# EAGLE design solarIn (EAGLE 7.1.0)
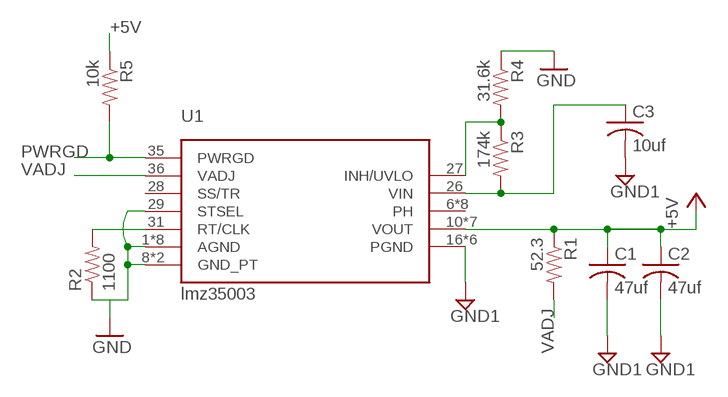
[diagram p0: schematic, sheet 1]

## Parts
C1  47uf  C-USC0805  [C0805]
C2  47uf  C-USC0805  [C0805]
C3  10uf  C-USC0805  [C0805]
R1  52.3  RESISTOR0603-RES  [0603-RES]
R2  1100  RESISTOR0603-RES  [0603-RES]
R3  174k  RESISTOR0603-RES  [0603-RES]
R4  31.6k  RESISTOR0603-RES  [0603-RES]
R5  10k  RESISTOR0603-RES  [0603-RES]
U1  LMZ35003  [S-PB1QFN-N41]

## Nets
+5V: R5.1
GND: R2.1 R4.1 U1.1(AGND) U1.4(AGND) U1.5(AGND) U1.8(GND_PT) U1.9(GND_PT) U1.29(STSEL) U1.30(AGND) U1.32(AGND) U1.33(AGND) U1.34(AGND) U1.37(AGND)
GND1: C1.2 C2.2 C3.2 U1.16(PGND) U1.17(PGND) U1.18(PGND) U1.19(PGND) U1.20(PGND) U1.40(PGND)
N$2: R2.2 U1.31(RT/CLK)
N$3: R3.1 R4.2 U1.27(INH/UVLO)
PWRGD: R5.2 U1.35(PWRGD)
VADJ: R1.2 U1.36(VADJ)
VIN: C3.1 R3.2 U1.26(VIN)
VOUT: C1.1 C2.1 R1.1 U1.10(VOUT) U1.11(VOUT) U1.12(VOUT) U1.13(VOUT) U1.14(VOUT) U1.15(VOUT) U1.39(VOUT) ; supply symbol labelled +5V
Unconnected: U1.6(PH) U1.7(PH) U1.21(PH) U1.22(PH) U1.23(PH) U1.24(PH) U1.28(SS/TR) U1.38(PH) U1.41(PH)

## Library data of the parts
C1-C3 = rcl:C-US: CAPACITOR, American symbol
R1-R5 = SparkFun-Passives:RESISTOR: Resistor Basic schematic elements and footprints for 0603, 1206, and PTH resistors.
U1 = texas:LMZ35003

## Board
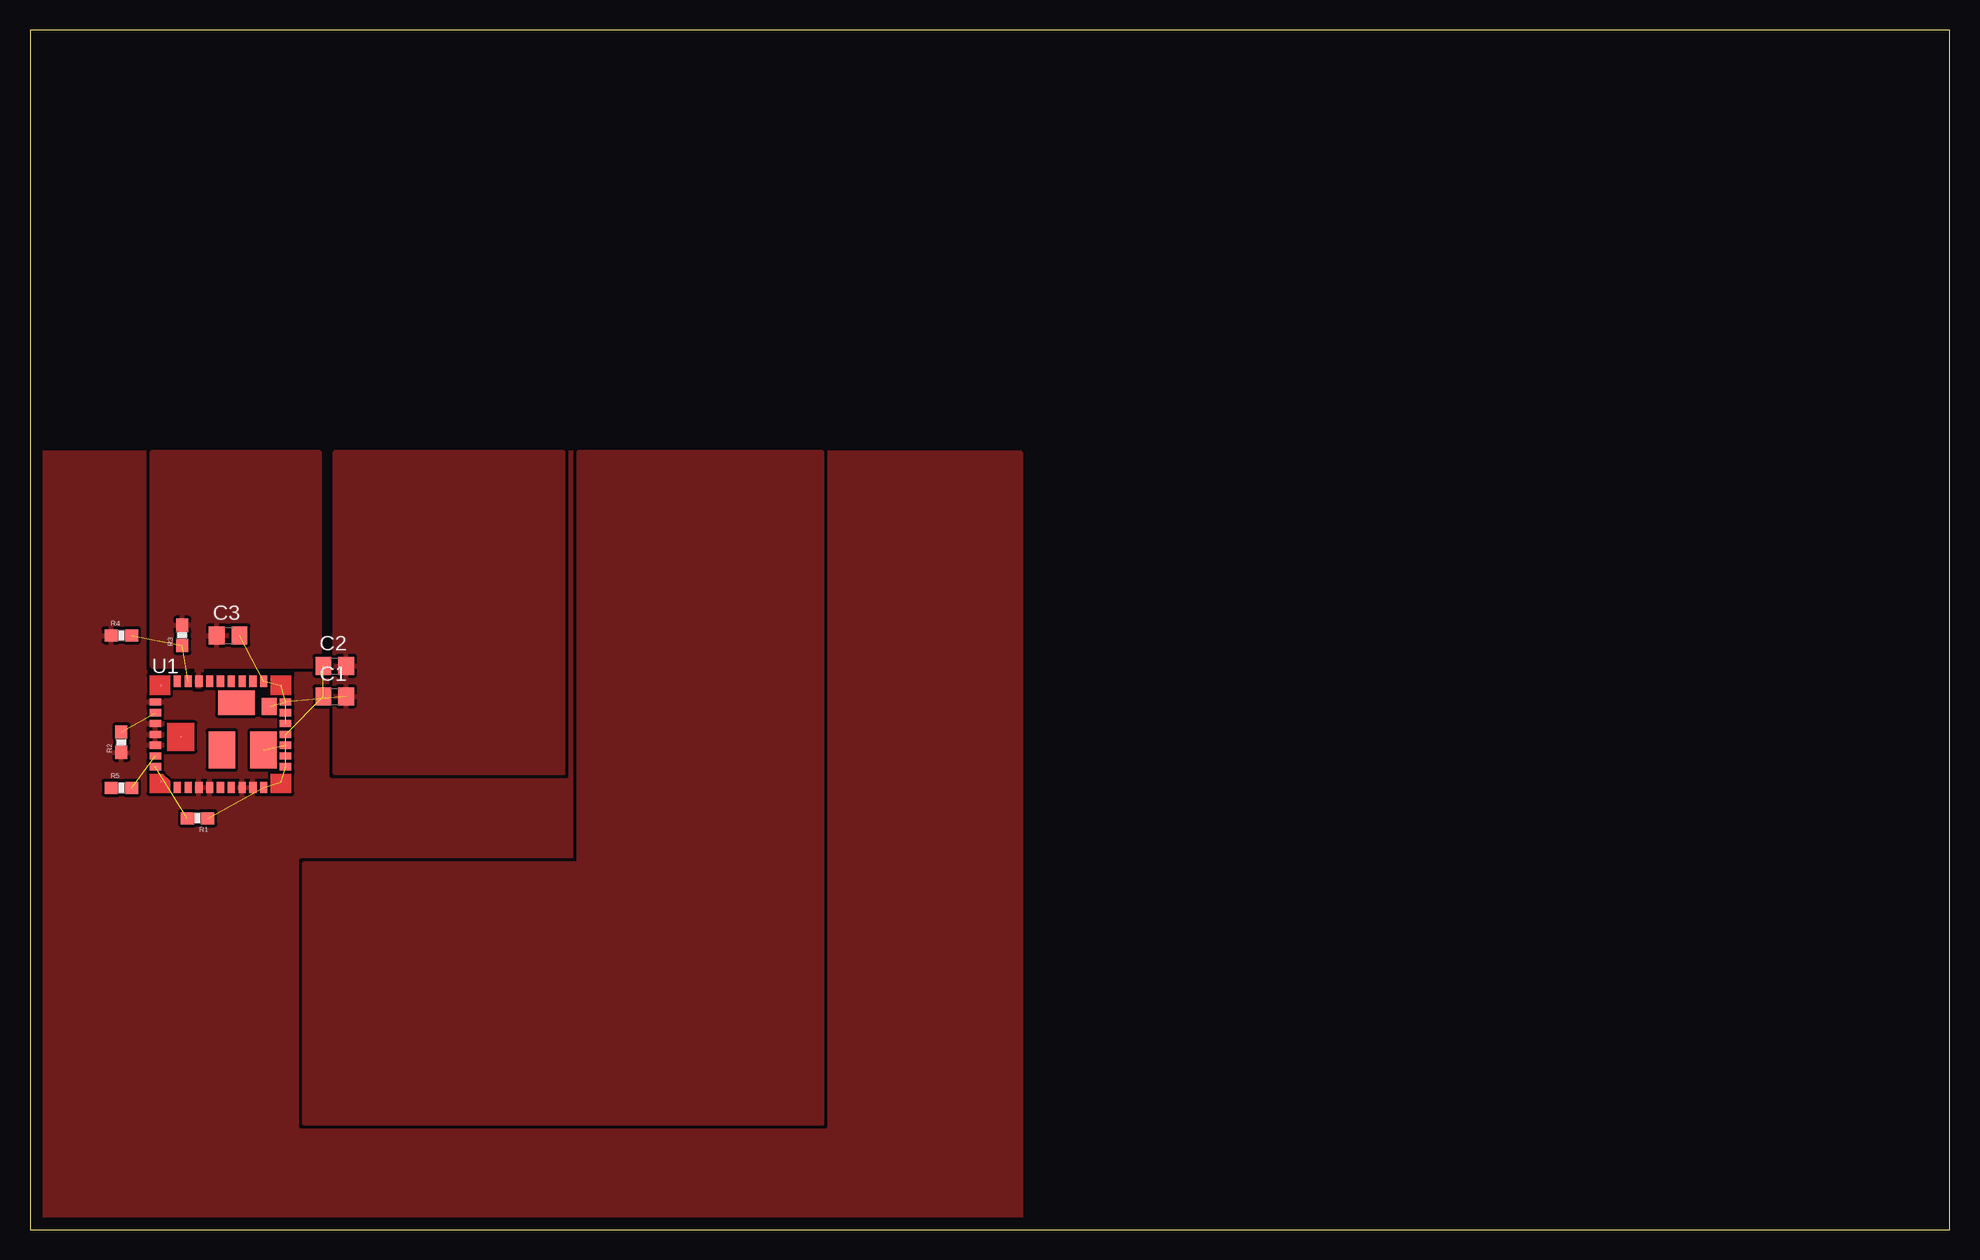
[diagram p1: board, top side]

Size 160 x 100 mm. Coordinates in mm from the lower left corner, seen from the top.
Outline: 0,0 160,0 160,100 0,100 0,0
Copper layers (1*16): Top 0.035mm / dielectric 1.5mm / Bottom 0.035mm
Design rules "default": minimum track width 10mil, minimum drill 24mil, track to track 8mil, track to pad 8mil, pad to pad 8mil, via to via 8mil, smd to smd 8mil, copper to edge 40mil, drill to drill 8mil, minimum pad ring 10mil, minimum via ring 8mil, stop-mask expansion 4mil, vias tented up to drill 0mil, thermal gap 10mil

### Footprints (pad centres in the part's own frame; a part is rotated, then mirrored left to right if it is on the bottom)
C0805 = smd 1.3 x 1.5: 1 -0.95,0; 2 0.95,0
0603-RES = smd 1.1 x 1: 1 -0.85,0; 2 0.85,0
S-PB1QFN-N41 = smd 0.1 x 0.1: 1 -4.95,-3.945; 11 5.05,-3.945; 19 5.05,4.055; 29 -4.95,4.055; 37 -3.3,-0.215 | smd 0.6 x 0.95: 2 -3.6,-4.42; 3 -2.7,-4.42; 4 -1.8,-4.42; 5 -0.9,-4.42; 6 0,-4.42; 7 0.9,-4.42; 8 1.8,-4.42; 9 2.7,-4.42; 10 3.6,-4.42; 20 3.6,4.42; 21 2.7,4.42; 22 1.8,4.42; 23 0.9,4.42; 24 0,4.42; 25 -0.9,4.42; 26 -1.8,4.42; 27 -2.7,4.42; 28 -3.6,4.42 | smd 0.95 x 0.6: 12 5.425,-2.695; 13 5.425,-1.795; 14 5.425,-0.895; 15 5.425,0.005; 16 5.425,0.905; 17 5.425,1.805; 18 5.425,2.705; 30 -5.425,2.705; 31 -5.425,1.805; 32 -5.425,0.905; 33 -5.425,0.005; 34 -5.425,-0.895; 35 -5.425,-1.795; 36 -5.425,-2.695 | smd 2.2 x 3.1: 38 0.11,-1.295; 39 3.59,-1.295 | smd 1.24 x 1.4: 40 4.06,2.335 | smd 3.05 x 2.04: 41 1.32,2.655

### Placement (x,y rotation side)
C1  25.4,44.45 0 top
C2  25.4,46.99 0 top
C3  16.51,49.53 0 top
R1  13.97,34.29 180 top
R2  7.62,40.64 90 top
R3  12.7,49.53 90 top
R4  7.62,49.53 0 top
R5  7.62,36.83 0 top
U1  15.88,41.27 0 top

### Tracks (layer width: path | path; a pad name or v marks a point on that pad's centre or on a via)
+5V
  pour Top: 45.72,64.77 45.72,30.48 22.86,30.48 22.86,24.13 22.86,8.89 66.04,8.89 66.04,64.77
GND
  pour Top (isolate 0.254, rank 6): 0,64.77 82.55,64.77 82.55,0 0,0
GND1  (7 unrouted)
  pour Top: 25.4,64.77 25.4,38.1 44.45,38.1 44.45,64.77
N$2  (1 unrouted)
N$3  (2 unrouted)
PWRGD  (1 unrouted)
VADJ  (1 unrouted)
VIN
  pour Top (isolate 0.254): 10.16,64.77 10.16,46.99 13.9,46.99 13.9,45.3 14.3,45.3 14.3,47 15.24,47 15.24,46.99 24.13,46.99 24.13,64.77
VOUT  (9 unrouted)